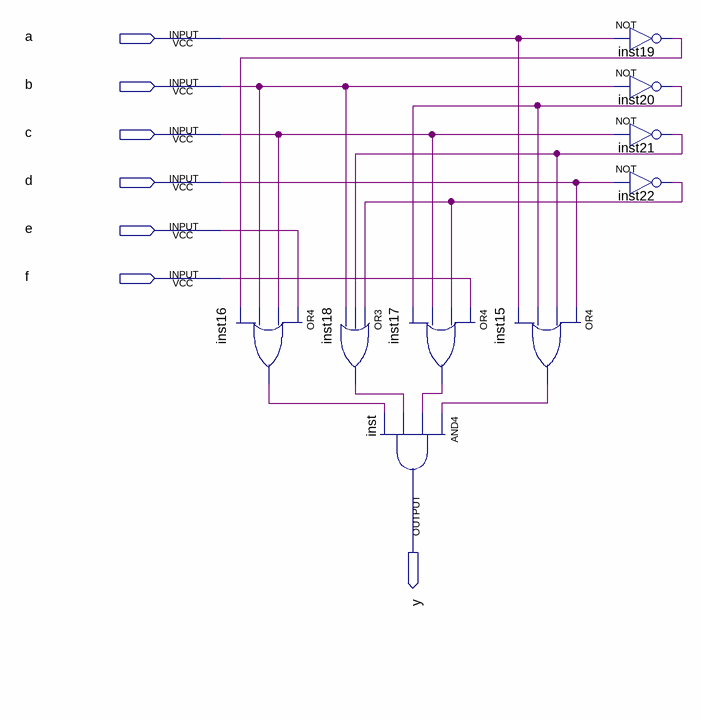
[diagram p0: schematic sheet]
// Quartus schematic hw9.bdf as structural Verilog: 9 symbols, 7 pins
module hw9 (
  input  a,
  input  b,
  input  c,
  input  d,
  input  e,
  input  f,
  output y
);

  wire inst15_out, inst16_out, inst17_out, inst18_out, inst19_out, inst20_out, inst21_out, inst22_out;

  or inst16 (inst16_out, e, c, b, inst19_out);
  or inst18 (inst18_out, inst22_out, inst21_out, b);
  or inst17 (inst17_out, f, inst22_out, c, inst20_out);
  and inst (y, inst15_out, inst17_out, inst18_out, inst16_out);
  or inst15 (inst15_out, d, inst21_out, inst20_out, a);
  not inst19 (inst19_out, a);
  not inst20 (inst20_out, b);
  not inst21 (inst21_out, c);
  not inst22 (inst22_out, d);
endmodule
